# Altium project Some.PrjPcb
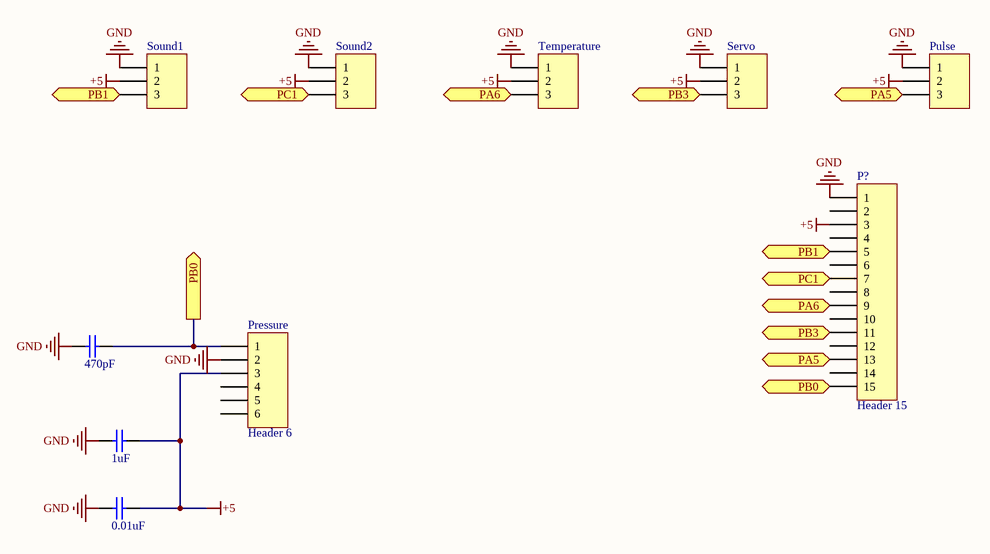
[diagram p0: Some-2.SchDoc]
1 sheet, 10 parts. Net scope: flat (ports and power ports of the same name join across sheets).
Board file: Some-2.PcbDoc

## Sheet Some-2.SchDoc
size A4

### Parts
0.01uF  Cap  [My_cap100n]  (value not drawn)
1uF  Cap  [My_cap100n]  (value not drawn)
470pF  Cap  [My_cap100n]  (value not drawn)
G_5_So1_So2_T_Se_Pu_Pr  Header 15  [HDR1X15]
Pressure  Header 6  [HDR1X6]
Pulse  (no value)  [HDR1X3]
Servo  (no value)  [HDR1X3]
Sound1  (no value)  [HDR1X3]
Sound2  (no value)  [HDR1X3]
Temperature  (no value)  [HDR1X3]

### Ports
PA5 (in), PA5 (out), PA6 (in), PA6 (out), PB0 (in), PB0 (out), PB1 (in), PB1 (out), PB3 (in), PB3 (out), PC1 (in), PC1 (out)

### Nets
+5: 0.01uF.2 1uF.2 G_5_So1_So2_T_Se_Pu_Pr.3 Pressure.3 Pulse.2 Servo.2 Sound1.2 Sound2.2 Temperature.2
GND: 0.01uF.1 1uF.1 470pF.1 G_5_So1_So2_T_Se_Pu_Pr.1 Pressure.2 Pulse.1 Servo.1 Sound1.1 Sound2.1 Temperature.1
Net470pF_2: 470pF.2 G_5_So1_So2_T_Se_Pu_Pr.15 Pressure.1 ; port PB0
NetG_5_So1_So2_T_Se_Pu_Pr_5: G_5_So1_So2_T_Se_Pu_Pr.5 Sound1.3 ; port PB1
NetG_5_So1_So2_T_Se_Pu_Pr_7: G_5_So1_So2_T_Se_Pu_Pr.7 Sound2.3 ; port PC1
NetG_5_So1_So2_T_Se_Pu_Pr_9: G_5_So1_So2_T_Se_Pu_Pr.9 Temperature.3 ; port PA6
NetG_5_So1_So2_T_Se_Pu_Pr_11: G_5_So1_So2_T_Se_Pu_Pr.11 Servo.3 ; port PB3
NetG_5_So1_So2_T_Se_Pu_Pr_13: G_5_So1_So2_T_Se_Pu_Pr.13 Pulse.3 ; port PA5

Not connected (* = marked no-connect by the designer): G_5_So1_So2_T_Se_Pu_Pr 2 4 6 8 10 12 14; Pressure 4 5 6

### Library data of the parts
0.01uF 1uF 470pF = Cap ceramic: CAP-100Nf; Value: 100nF
G_5_So1_So2_T_Se_Pu_Pr = Header 15: Header, 15-Pin
Pressure = Header 6: Header, 6-Pin; LatestRevisionDate: 17-Jul-2002; LatestRevisionNote: Re-released for DXP Platform.; Publisher: Altium Limited
Pulse Servo Sound1 Sound2 Temperature = Header 3: Header, 3-Pin; LatestRevisionDate: 17-Jul-2002; LatestRevisionNote: Re-released for DXP Platform.; Publisher: Altium Limited